# Altium schematic sheet 自动供水系统.SchDoc
size A4
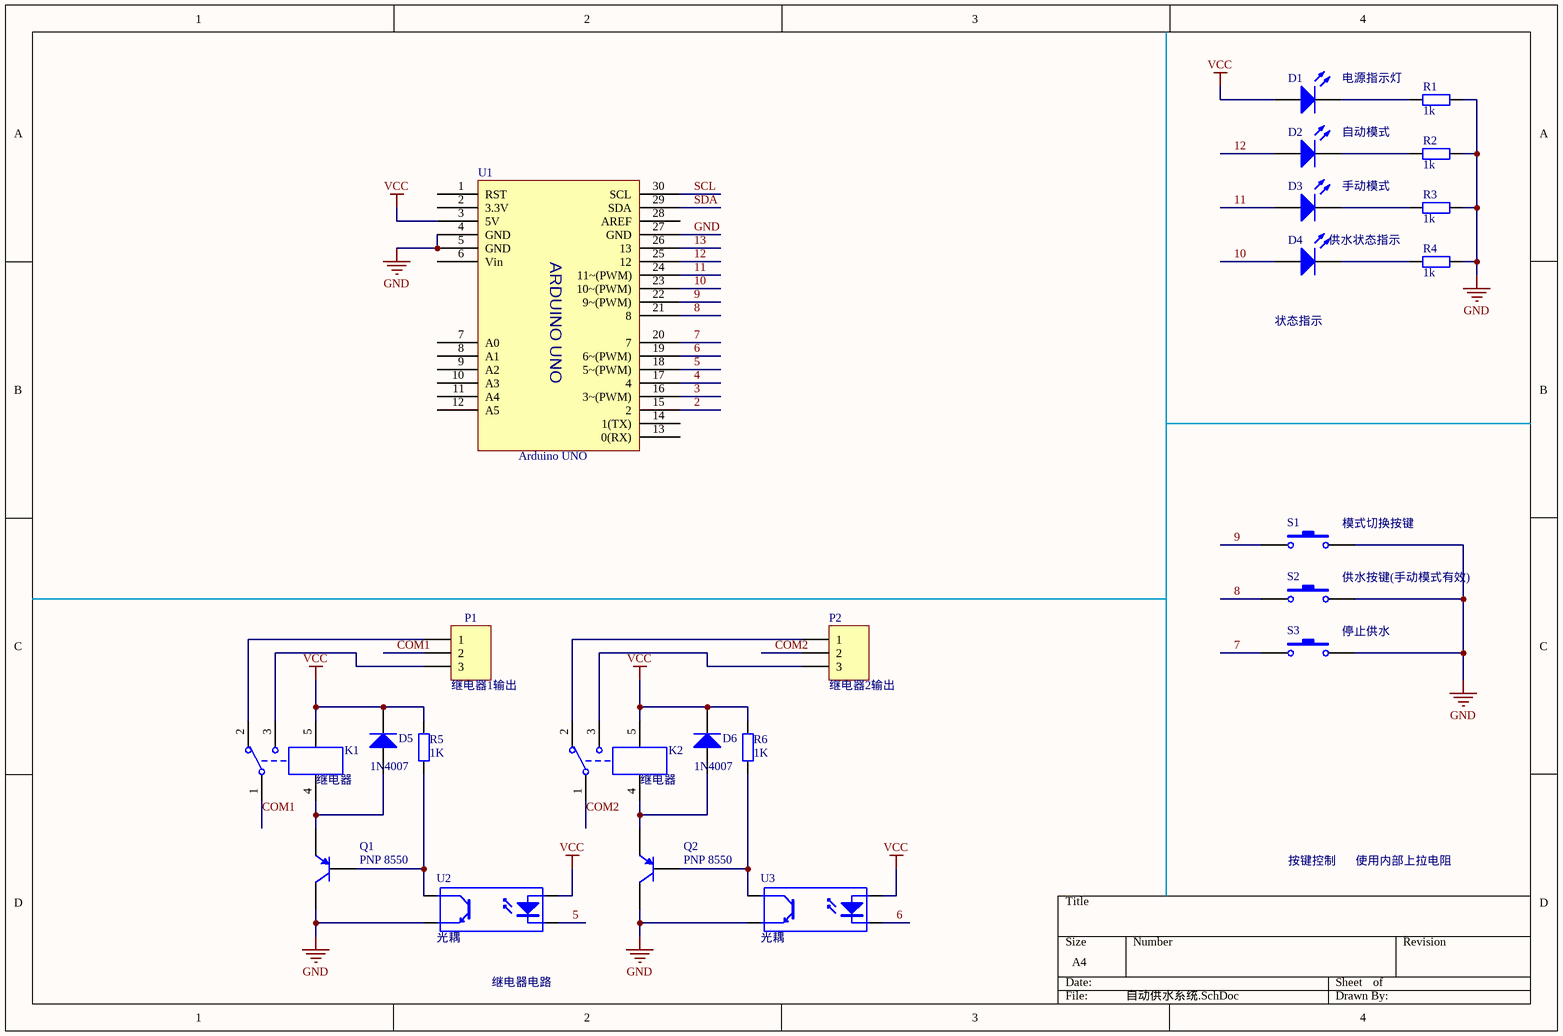
[diagram p0: 自动供水系统.SchDoc]

## Parts
D1  LED0  [LED-0]  (value not drawn)
D2  LED0  [LED-0]  (value not drawn)
D3  LED0  [LED-0]  (value not drawn)
D4  LED0  [LED-0]  (value not drawn)
D5  1N4007  [AXIAL-0.4]
D6  1N4007  [AXIAL-0.4]
K1  继电器  [继电器]
K2  继电器  [继电器]
P1  继电器1输出  [接线端子]
P2  继电器2输出  [接线端子]
Q1  PNP 8550  [三极管]
Q2  PNP 8550  [三极管]
R1  value 1k  [AXIAL-0.4]  (hidden comment: Res2)
R2  value 1k  [AXIAL-0.4]  (hidden comment: Res2)
R3  value 1k  [AXIAL-0.4]  (hidden comment: Res2)
R4  value 1k  [AXIAL-0.4]  (hidden comment: Res2)
R5  value 1K  [AXIAL-0.4]  (hidden comment: Res2)
R6  value 1K  [AXIAL-0.4]  (hidden comment: Res2)
S1  SW-PB  [SPST-2]  (value not drawn)
S2  SW-PB  [SPST-2]  (value not drawn)
S3  SW-PB  [SPST-2]  (value not drawn)
U1  Arduino UNO  [Arduino UNO]
U2  光耦  [DIP-4]
U3  光耦  [DIP-4]

## Nets
GND: Q1.3(C) Q2.3(C) R1.2 R2.2 R3.2 R4.2 S1.2 S2.2 S3.2 U1.4(GND) U1.5(GND) U1.27(GND) U2.3(E) U3.3(E)
VCC: D1.1(A) D5.2(K) D6.2(K) K1.5 K2.5 R5.2 R6.2 U1.3(5V) U2.1(A) U3.1(A)
2: U1.15(2)
3: U1.16(3~(PWM))
4: U1.17(4)
5: U1.18(5~(PWM)) U2.2(K)
6: U1.19(6~(PWM)) U3.2(K)
7: S3.1 U1.20(7)
8: S2.1 U1.21(8)
9: S1.1 U1.22(9~(PWM))
10: D4.1(A) U1.23(10~(PWM))
11: D3.1(A) U1.24(11~(PWM))
12: D2.1(A) U1.25(12)
13: U1.26(13)
COM1: K1.1 P1.2
COM2: K2.1 P2.2
SCL: U1.30(SCL)
SDA: U1.29(SDA)
NetD1_2: D1.2(K) R1.1
NetD2_2: D2.2(K) R2.1
NetD3_2: D3.2(K) R3.1
NetD4_2: D4.2(K) R4.1
NetD5_1: D5.1(A) K1.4 Q1.1(E)
NetD6_1: D6.1(A) K2.4 Q2.1(E)
NetK1_2: K1.2 P1.1
NetK1_3: K1.3 P1.3
NetK2_2: K2.2 P2.1
NetK2_3: K2.3 P2.3
NetQ1_2: Q1.2(B) R5.1 U2.4(C)
NetQ2_2: Q2.2(B) R6.1 U3.4(C)

Not connected (* = marked no-connect by the designer): U1 1(RST) 2(3.3V) 6(Vin) 7(A0) 8(A1) 9(A2) 10(A3) 11(A4) 12(A5) 13(0(RX)) 14(1(TX)) 28(AREF)

## Notes on the sheet
- (near D1) 电源指示灯
- 自动模式
- 供水状态指示
- 手动模式
- 状态指示
- (near S1) 模式切换按键
- 供水按键(手动模式有效)
- 停止供水
- 按键控制
- 使用内部上拉电阻
- 继电器电路
- (in symbol Arduino UNO) ARDUINO UNO

## Library data of the parts
D1-D4 = LED0: Typical INFRARED GaAs LED; Published: 8-Jun-2000; LatestRevisionDate: 08-Jul-2005; LatestRevisionNote: Mech Layer 1 removed.; PackageReference: LED-0; Publisher: Altium Limited; PackageDescription: LED; 2 Leads
D5 D6 = Diode: Default Diode; Published: 8-Jun-2000; LatestRevisionDate: 17-Jul-2002; LatestRevisionNote: Re-released for DXP Platform.; PackageVersion: Sep-1996; PackageReference: SMC; Publisher: Altium Limited; PackageDescription: DO-214-AB/SMC; 2 C-Bend Leads; Body 7.9 x 5.9 mm, inc. leads (LxW); Code_JEDEC: DO-214-AB
P1 P2 = Header 3: Header, 3-Pin; LatestRevisionDate: 17-Jul-2002; LatestRevisionNote: Re-released for DXP Platform.; Publisher: Altium Limited
Q1 Q2 = 2N3906: PNP General Purpose Amplifier; pin to pad: 1>E 2>B 3>C; Published: 8-Jun-2000; LatestRevisionDate: 15-Jan-2003; LatestRevisionNote: PCB Footprint 'BCY-W3/D4.7' replaced; DatasheetVersion: 1997; PackageVersion: Sep-1998; PackageReference: TO-92A; Publisher: Altium Limited; PackageDescription: TO, Flat Index; 3 In-Line, Axial Leads; Body Dia. 4.5mm; Leads 0.51 x 0.48 mm (max); ComponentLink1Description: Manufacturer Link; ComponentLink1URL: http://www.fairchildsemi.com/; ComponentLink2Description: Datasheet; ComponentLink2URL: http://www.fairchildsemi.com/ds/2N%2F2N3906.pdf
R1-R6 = Res2: Resistor; Published: 8-Jun-2000; LatestRevisionDate: 17-Jul-2002; LatestRevisionNote: Re-released for DXP Platform.; PackageReference: AXIAL-0.4; Publisher: Altium Limited; PackageDescription: Axial Device, Thru-Hole; 2 Leads; 0.4 in Pin Spacing
S1-S3 = SW-PB: Switch; Published: 24-Mar-1999; LatestRevisionDate: 17-Jul-2002; LatestRevisionNote: Re-released for DXP Platform.; PackageReference: SPST-2; Publisher: Altium Limited; PackageDescription: Switch; 2 Leads
U2 U3 = Optoisolator1: 4-Pin Phototransistor Optocoupler; Published: 24-Mar-1999; LatestRevisionDate: 04-Mar-2005; LatestRevisionNote: Sch pins 3 & 4 Swapped.; DatasheetVersion: Nov-2003; PackageReference: DIP-4; Publisher: Altium Limited